# Altium schematic sheet +15V_fire.SchDoc
size A3
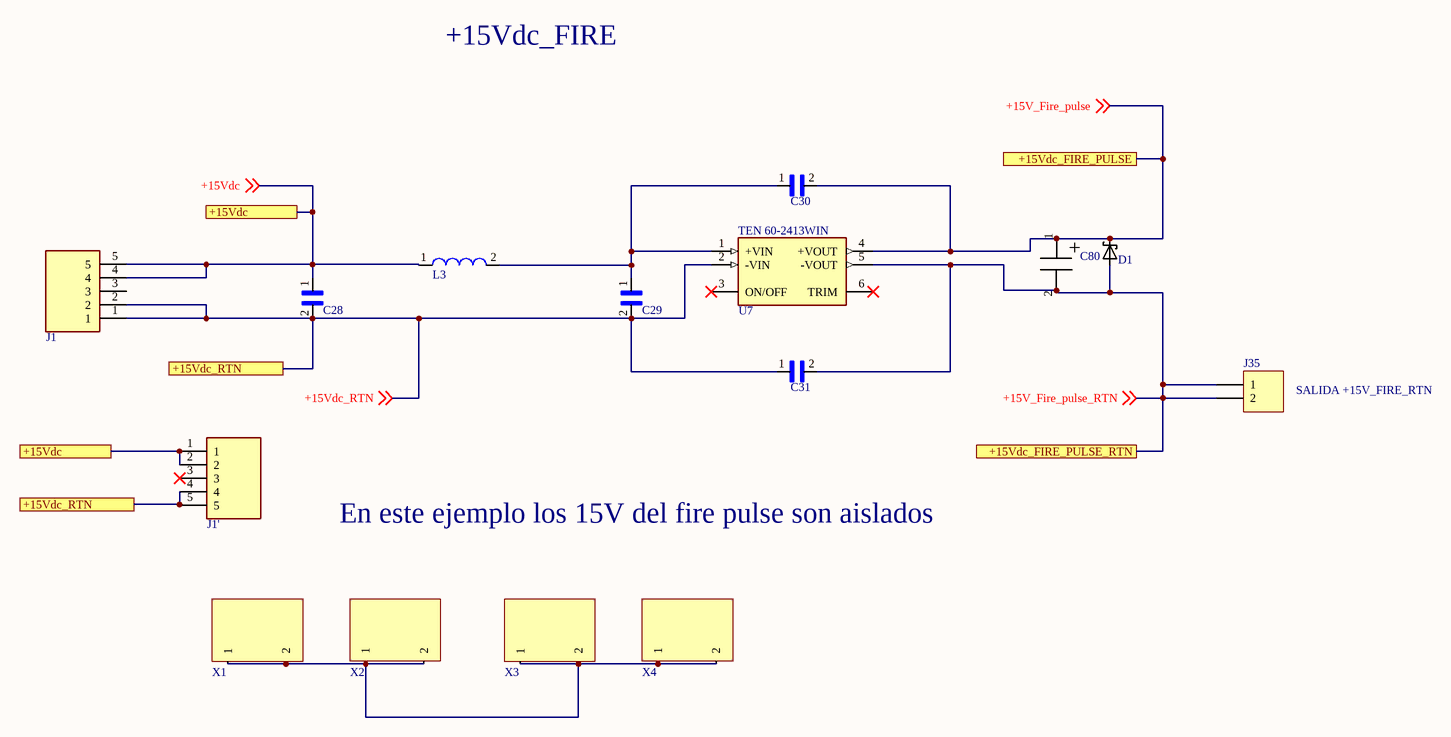
[diagram p0: +15V_fire.SchDoc]

## Parts
C28  KTF500B685M43NHT00  [MLCC SMD 1812 50V]  (value not drawn)
C29  KTF500B685M43NHT00  [MLCC SMD 1812 50V]  (value not drawn)
C30  C1206X102KGRACAUTO  [MLCC SMD 1206]  (value not drawn)
C31  C1206X102KGRACAUTO  [MLCC SMD 1206]  (value not drawn)
C80  EEE-FK1V100R  [PANASONIC FK SERIES]  (value not drawn)
D1  SMCJ15A  [TVS Diode DO-214AB-2 (SMC)]  (value not drawn)
J1  Pin Header 5x1 MASC  [PIN HEADER 5X1 MASC]  (value not drawn)
J1'  Pin Header 5x1 MASC  [PIN HEADER 5X1 MASC]  (value not drawn)
J35  Header 2  [HDR1X2]  (value not drawn)
L3  TCK-102  [TCK-102]  (value not drawn)
U7  TEN 60-2413WIN  [TEN 60WIN Series]
X1  7466310R  [7466310R]  (value not drawn)
X2  7466310R  [7466310R]  (value not drawn)
X3  7466310R  [7466310R]  (value not drawn)
X4  7466310R  [7466310R]  (value not drawn)

## Ports
+15Vdc, +15Vdc_FIRE_PULSE, +15Vdc_FIRE_PULSE_RTN, +15Vdc_RTN

## Nets
+15V_Fire_pulse: C30.2 C80.1 D1.C U7.4(+VOUT) ; off-sheet +15V_Fire_pulse, port +15Vdc_FIRE_PULSE
+15V_Fire_pulse_RTN: C31.2 C80.2 D1.A J35.1 J35.2 U7.5(-VOUT) ; off-sheet +15V_Fire_pulse_RTN, port +15Vdc_FIRE_PULSE_RTN
+15Vdc: C28.1 J1.4 J1.5 J1'.1 J1'.2 L3.1 ; off-sheet +15Vdc, port +15Vdc
+15Vdc_RTN: C28.2 C29.2 C31.1 J1.1 J1.2 J1'.4 J1'.5 U7.2(-VIN) ; off-sheet +15Vdc_RTN, port +15Vdc_RTN
NetC29_1: C29.1 C30.1 L3.2 U7.1(+VIN)
NetX1_1: X1.1 X1.2 X2.1 X2.2 X3.1 X3.2 X4.1 X4.2

Not connected (* = marked no-connect by the designer): J1 3; J1' 3*; U7 3(ON/OFF)* 6(TRIM)*

## Notes on the sheet
- +15Vdc_FIRE
- (near J35) SALIDA +15V_FIRE_RTN
- En este ejemplo los 15V del fire pulse son aislados
- (in symbol Panasonic electrolitic cap FK) +

## Library data of the parts
C28 C29 = MLCC - SMD 1812: 6.8uF, 50V; ComponentLink1Description: KTF500B685M43NHT00; ComponentLink1URL: https://www.mouser.es/ProductDetail/United-Chemi-Con/KTF500B685M43NHT00?qs=sGAEpiMZZMs0AnBnWHyRQGxBDRtFRp5z4bchVqSxespDGMPT39T5iA%3D%3D
C30 C31 = MLCC - SMD 1206: 1000Pf, 2KV; ComponentLink1Description: C1206X102KGRACAUTO; ComponentLink1URL: https://www.mouser.es/ProductDetail/KEMET/C1206X102KGRACAUTO?qs=sGAEpiMZZMs0AnBnWHyRQN7%2FAA2D2lPPgicmiaZAeQEuINLX1UMksw%3D%3D
C80 = Panasonic electrolitic cap FK: 10uF, 35V; ComponentLink1Description: EEE-FK1V100R; ComponentLink1URL: https://www.mouser.es/ProductDetail/Panasonic/EEE-FK1V100R?qs=%2Fha2pyFaduj%2FIt2M0EHCFH6KCxiBIGyUhvn03lKjROYI3CJTVtBsWg%3D%3D
D1 = TVS SMCJxxA: SMC do-214AB-2; ComponentLink1Description: SMCJ15A; ComponentLink1URL: https://www.mouser.es/ProductDetail/Taiwan-Semiconductor/SMCJ15A?qs=sGAEpiMZZMvxHShE6Whpu8fatLI1nnJdRhHnBKQQd%2F4%3D
J1 J1' = Pin Header 5x1 MASC: 5x1 Straight MASC
J35 = Header 2: Header, 2-Pin; LatestRevisionDate: 17-Jul-2002; LatestRevisionNote: Re-released for DXP Platform.; Publisher: Altium Limited
L3 = TCK-102: Inductores fijos EMC Chokes for DC/DC Converters 3.3 µH ±20% 18 mOhm max. 10Amax; ComponentLink1Description: TCK-102; ComponentLink1URL: https://www.mouser.es/datasheet/2/687/tck102-1530275.pdf; ComponentLink2Description: TCK-102; ComponentLink2URL: https://www.mouser.es/ProductDetail/TRACO-Power/TCK-102?qs=sGAEpiMZZMvzWM6X48YRJGsDNyjYsBLz4RP5FeQoV5Q%3D
U7 = TEN 60-2413WIN: Convertidores CC/CC aislados  Output Power (W): 60; Input Voltage: 9-36 VDC; Output 1 (Vdc): 15;; ComponentLink1Description: Datasheet; ComponentLink1URL: https://www.tracopower.com/sites/default/files/products/datasheets/ten60win_datasheet.pdf; ComponentLink2Description: TEN 60-2413WIN; ComponentLink2URL: https://www.mouser.es/ProductDetail/TRACO-Power/TEN-60-2413WIN?qs=sGAEpiMZZMvGsmoEFRKS8GuhBnqedIdiF3IPykuOfGu%2FdWm0yPRwSg%3D%3D
X1-X4 = 7466310R Conector: ComponentLink1Description: 7466310R; ComponentLink1URL: https://es.rs-online.com/web/p/terminales-roscados/1424083/